# EAGLE design YARC_ID_Timer (EAGLE 7.2.0)
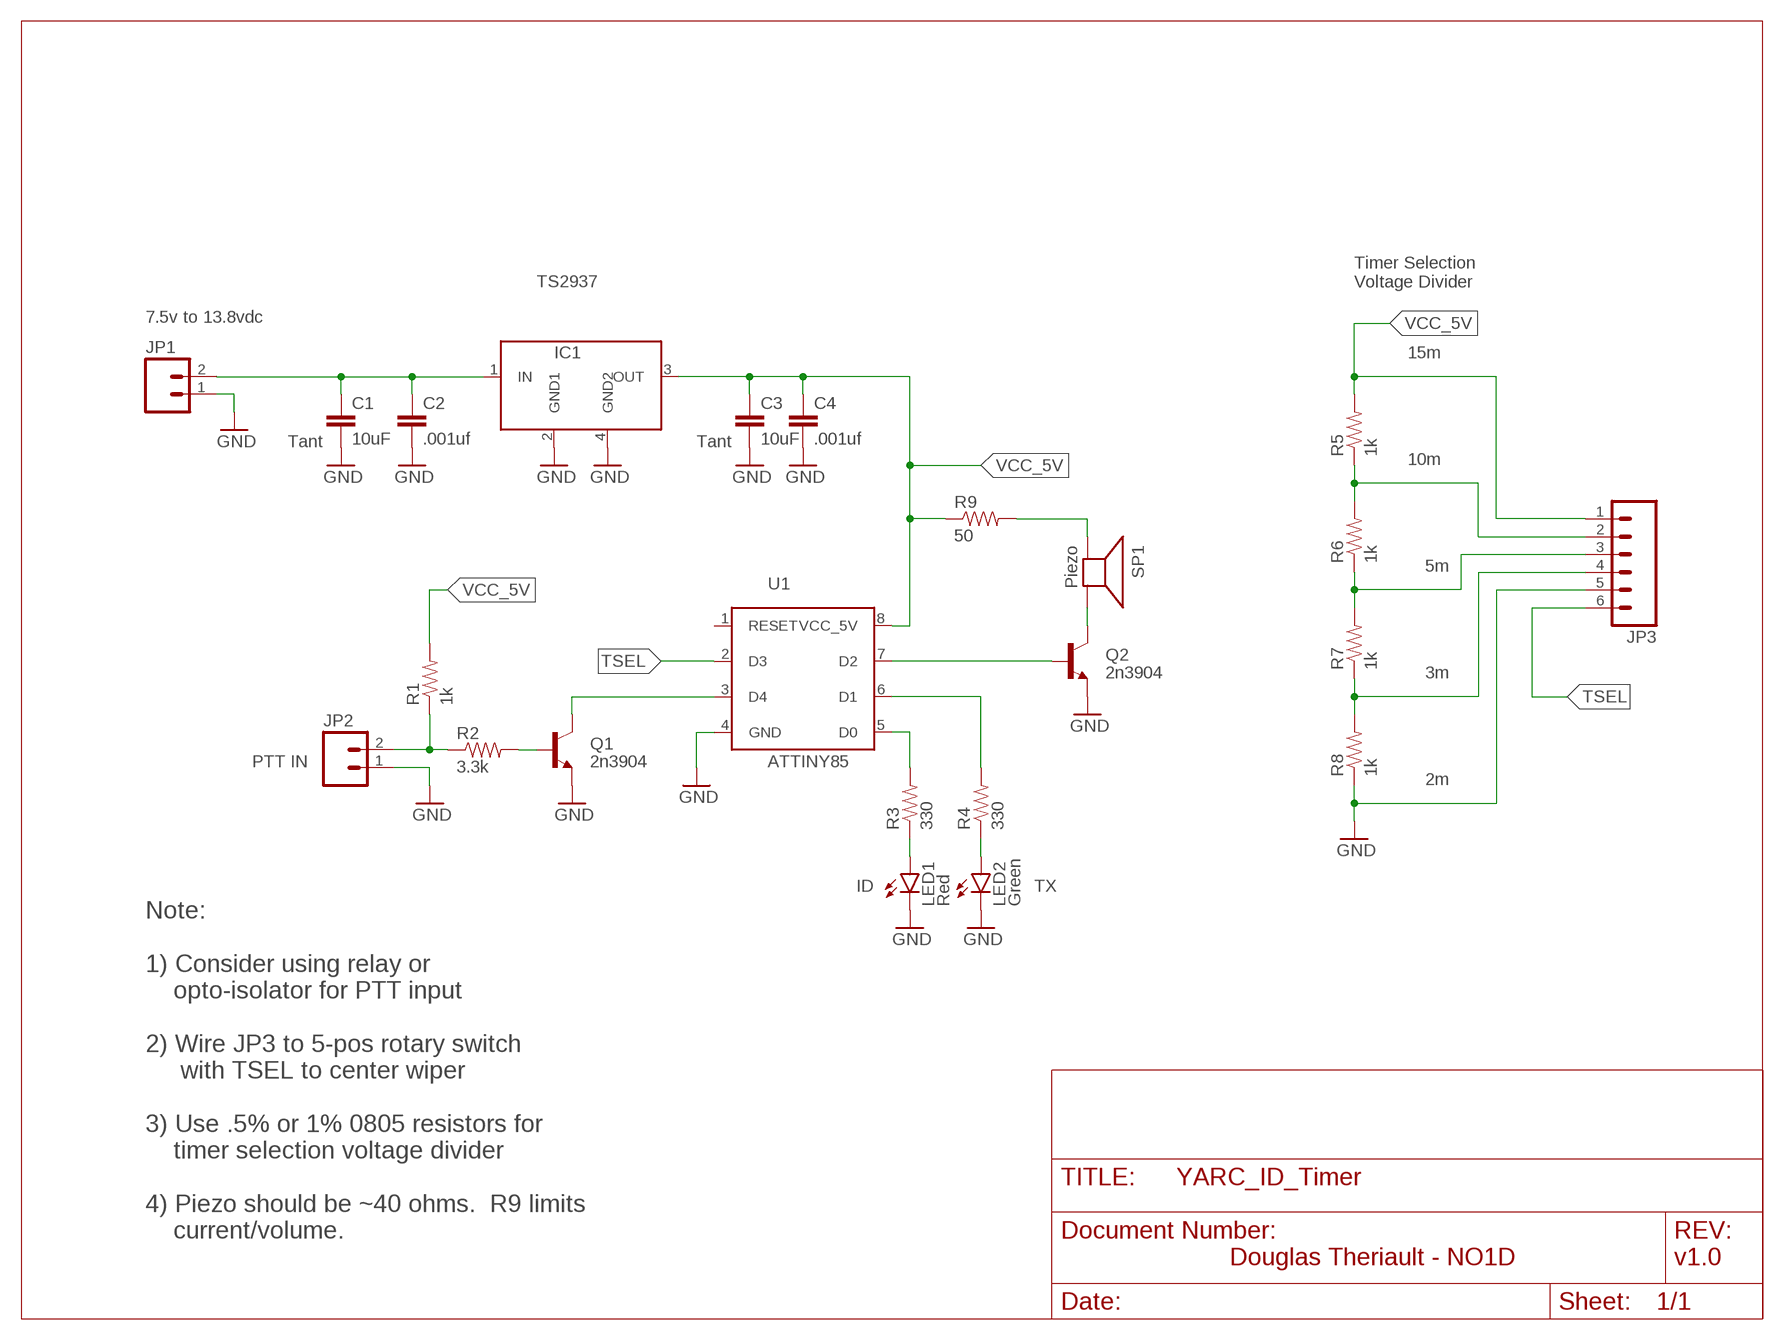
[diagram p0: schematic, sheet 1]

## Parts
C1  10uF  CAP1210  [1210]
C2  .001uf  CAP0805  [0805]
C3  10uF  CAP0805  [0805]
C4  .001uf  CAP0805  [0805]
IC1  TS2937  [SOT223]
JP1  M02LOCK_LONGPADS  [1X02_LOCK_LONGPADS]
JP2  M02LOCK_LONGPADS  [1X02_LOCK_LONGPADS]
JP3  M06LONGPADS  [1X06_LONGPADS]
LED1  Red  LED5MM  [LED5MM]
LED2  Green  LED5MM  [LED5MM]
Q1  2n3904  TRANSISTOR_NPN2N3904  [TO-92]
Q2  2n3904  TRANSISTOR_NPN2N3904  [TO-92]
R1  1k  RESISTOR0805-RES  [0805]
R2  3.3k  RESISTOR0805-RES  [0805]
R3  330  RESISTOR0805-RES  [0805]
R4  330  RESISTOR0805-RES  [0805]
R5  1k  RESISTOR0805-RES  [0805]
R6  1k  RESISTOR0805-RES  [0805]
R7  1k  RESISTOR0805-RES  [0805]
R8  1k  RESISTOR0805-RES  [0805]
R9  50  RESISTOR0805-RES  [0805]
SP1  Piezo  SPEAKER/AL60P  [AL60P]
U1  ATTINY85  [DIP08]

## Nets
GND: C1.2 C2.2 C3.2 C4.2 IC1.2(GND1) IC1.4(GND2) JP1.1 JP2.1 JP3.5 LED1.K(C) LED2.K(C) Q1.1(E) Q2.1(E) R8.1 U1.4(GND)
N$1: LED1.A R3.1
N$2: Q2.2(B) U1.7(D2)
N$3: Q2.3(C) SP1.2(-)
N$4: R9.2 SP1.1(+)
N$6: LED2.A R4.1
N$8: R3.2 U1.5(D0)
N$9: R4.2 U1.6(D1)
N$10: Q1.3(C) U1.3(D4)
N$11: Q1.2(B) R2.2
N$12: JP2.2 R1.1 R2.1
N$13: C1.1 C2.1 IC1.1(IN) JP1.2
N$14: JP3.2 R5.1 R6.2
N$15: JP3.3 R6.1 R7.2
N$16: JP3.4 R7.1 R8.2
TSEL: JP3.6 U1.2(D3)
VCC_5V: C3.1 C4.1 IC1.3(OUT) JP3.1 R1.2 R5.2 R9.1 U1.8(VCC_5V)
Unconnected: U1.1(RESET)

## Notes on the sheet
- Timer Selection
  Voltage Divider
- 7.5v to 13.8vdc
- 15m
- Tant | Tant
- 10m
- 5m
- 3m
- PTT IN
- 2m
- ID | TX
- Note:
  
  1) Consider using relay or 
      opto-isolator for PTT input
  
  2) Wire JP3 to 5-pos rotary switch
       with TSEL to center wiper
  
  3) Use .5% or 1% 0805 resistors for
      timer selection voltage divider
  
  4) Piezo should be ~40 ohms.  R9 limits
      current/volume.
- Douglas Theriault - NO1D | v1.0

## Library data of the parts
C1-C4 = SparkFun-Passives:CAP: Capacitor Standard 0603 ceramic capacitor, and 0.1" leaded capacitor.
IC1 = dt-semis:TS2937
JP1 JP2 = SparkFun-Connectors:M02: Standard 2-pin 0.1" header. Use with - straight break away headers ( PRT-00116) - right angle break away headers (PRT-00553) - swiss pins (PRT-00743) - machine pins (PRT-00117) - female headers (PRT-00115) Molex polarized connector foot print use with: PRT-08233 with associated crimp pins and housings. 2.54_SCREWTERM for use with PRT-10571. 3.5mm Screw Terminal footprints for PRT-08084 5mm Screw Terminal footprints for use with PRT-08432
JP3 = SparkFun-Connectors:M06: Header 6 Standard 6-pin 0.1" header. Use with straight break away headers (SKU : PRT-00116), right angle break away headers (PRT-00553), swiss pins (PRT-00743), machine pins (PRT-00117), and female headers (PRT-00115). Molex polarized connector foot print use with SKU : PRT-08094 with associated crimp pins and housings. NOTES ON THE VARIANTS LOCK and LOCK_LONGPADS... This footprint was designed to help hold the alignment of a through-hole component (i.e. 6-pin header) while soldering it into place. You may notice that each hole has been shifted either up or down by 0.005 of an inch from it's more standard position (which is a perfectly straight line). This slight alteration caused the pins (the squares in the middle) to touch the edges of the holes. Because they are alternating, it causes a "brace" to hold the component in place. 0.005 has proven to be the perfect amount of "off-center" position when using our standard breakaway headers. Although looks a little odd when you look at the bare footprint, once you have a header in there, the alteration is very hard to notice. Also,if you push a header all the way into place, it is covered up entirely on the bottom side. This idea of altering the position of holes to aid alignment will be further integrated into the Sparkfun Library for other footprints. It can help hold any component with 3 or more connection pins.
LED1 LED2 = SparkFun-LED:LED: LEDs Standard schematic elements and footprints for 5mm, 3mm, 1206, and 0603 sized LEDs. 5mm - Spark Fun Electronics SKU : COM-00529 (and others)
Q1 Q2 = SparkFun-DiscreteSemi:TRANSISTOR_NPN: Generic NPN BJT MMBT2222A - TRANS-08049 (SOT-23, 1A 40V) MPSA42 - TRANS-09116 (SOT-23, 500mA 300V) MMBT5088LT1G - TRANS-11160 (SOT-23, 50 mA 30V) BC547 - COM-08928 <http://www.sparkfun.com/products/8928> (TO-92 45V 100mA) (1.Collector 2.Base 3.Emitter) 2N3904 - COM-00521 <http://www.sparkfun.com/products/521> (TO-92 40V 200mA) (1.Emitter 2.Base 3.Collector) P2N2222A - COM-12852 <http://www.sparkfun.com/products/12852> (TO-92 40V 600mA) (1.Collector 2.Base 3.Emitter); PROD_ID: TRANS-08447
R1-R9 = SparkFun-Passives:RESISTOR: Resistor Basic schematic elements and footprints for 0603, 1206, and PTH resistors.
SP1 = adafruit:SPEAKER: SPEAKER Source: Buerklin Added PS12 (for part # PS1240 piezo) http://www.ladyada.net/library/pcb/eaglelibrary.html
U1 = dt-semis:ATTINY85

## Board
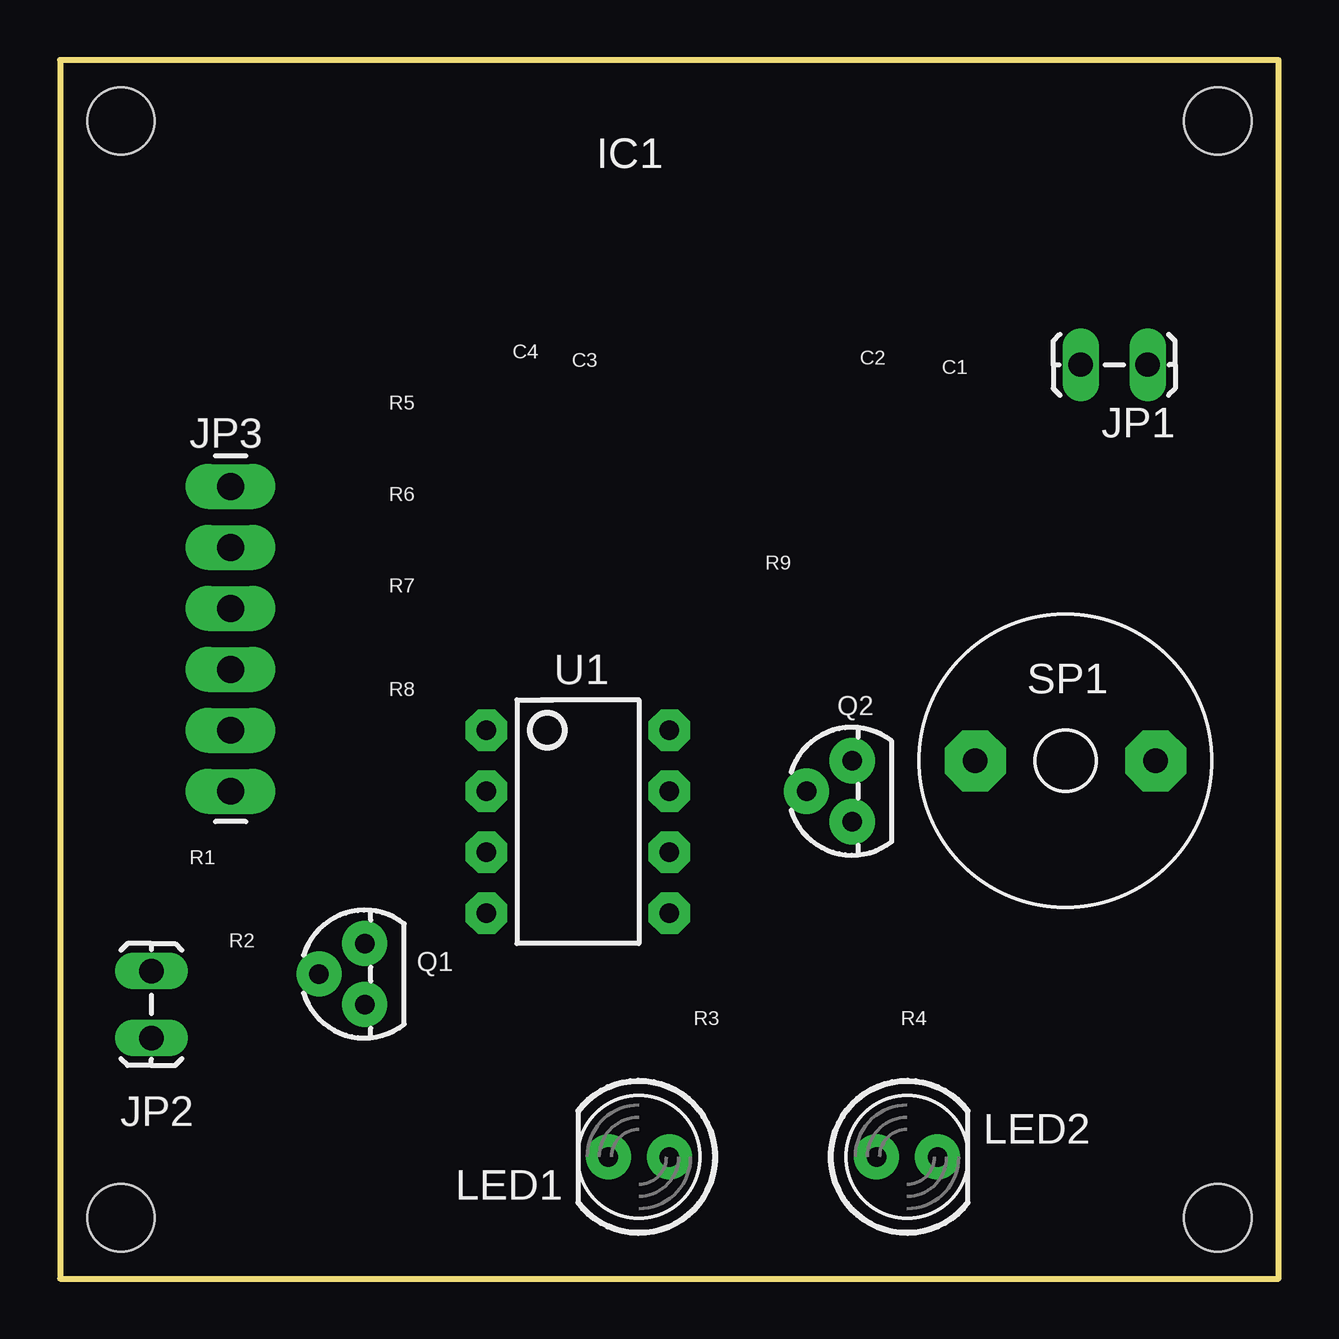
[diagram p1: board, top side]
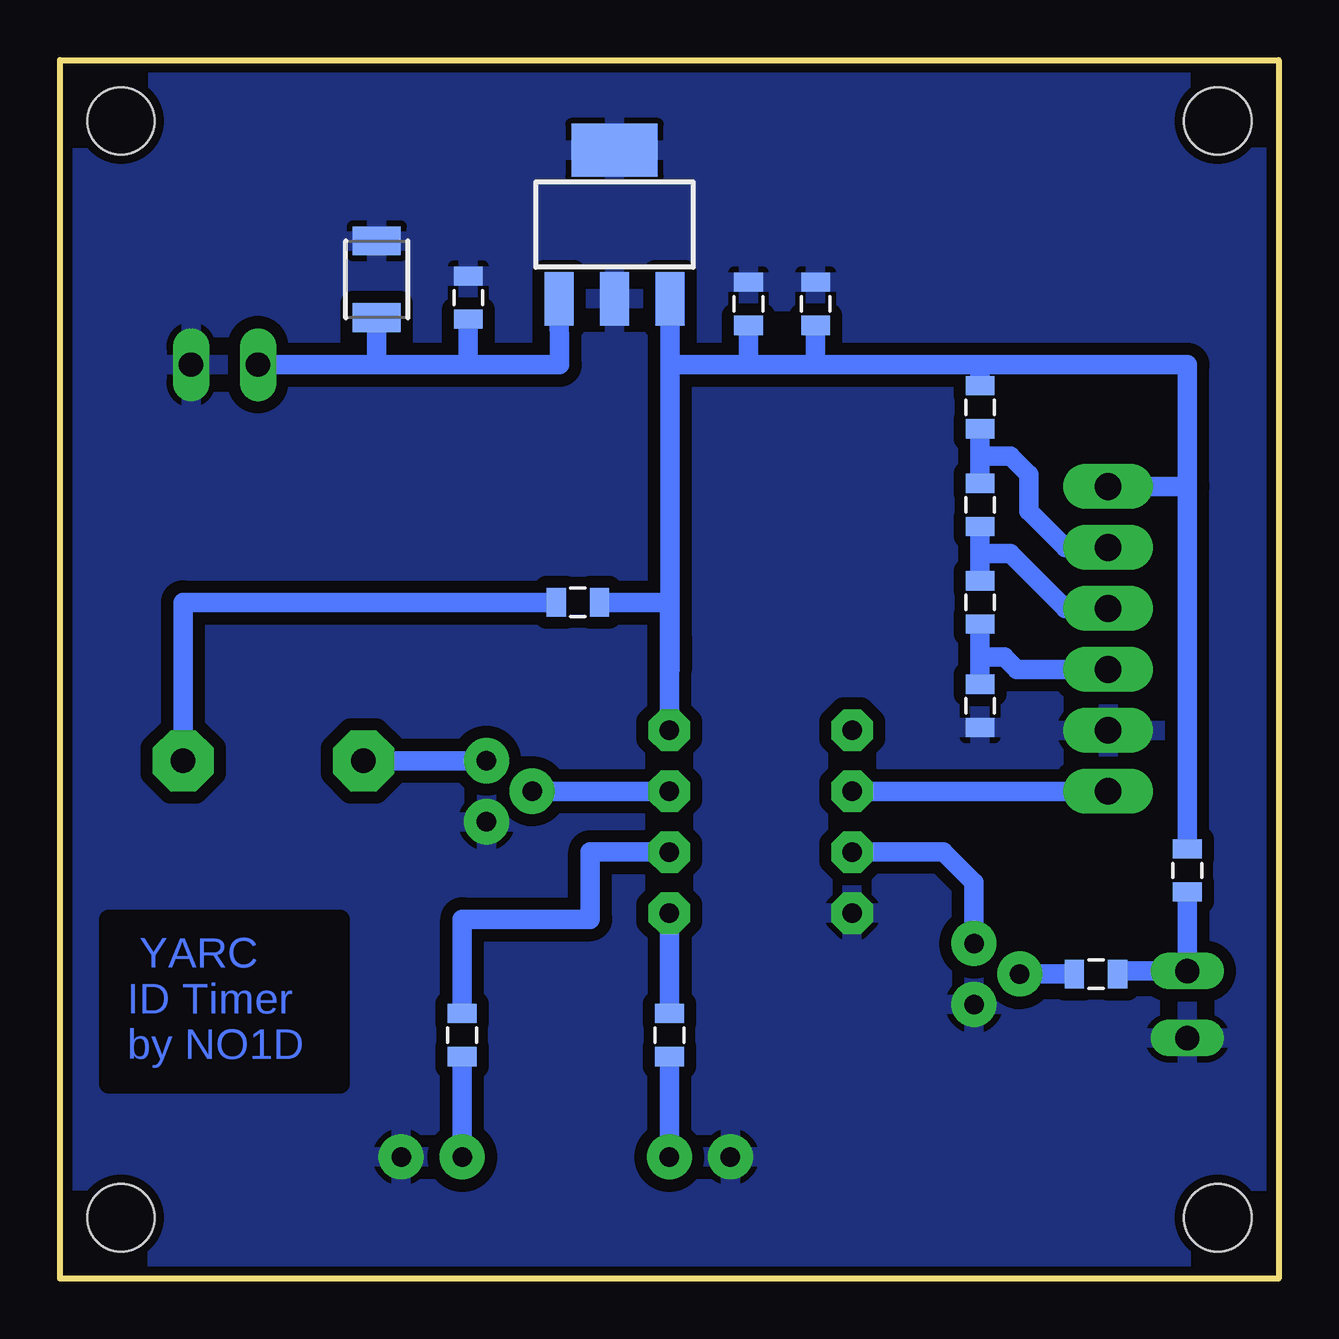
[diagram p2: board, bottom side, seen from below]

Size 50.8 x 50.8 mm. Coordinates in mm from the lower left corner, seen from the top.
Outline: 0,0 50.8,0 50.8,50.8 0,50.8 0,0
Copper layers (1*16): Top 0.0356mm / dielectric 1.5011mm / Bottom 0.0356mm
Design rules "LaenPCBOrder *": minimum track width 6mil, minimum drill 13mil, track to track 20mil, track to pad 20mil, pad to pad 16mil, via to via 6mil, smd to smd 6mil, copper to edge 15mil, drill to drill 6mil, minimum pad ring 7mil, minimum via ring 7mil, stop-mask expansion 3mil, vias tented up to drill 0mil, thermal gap 10mil
Holes 2.8 mm at 2.54,48.26 48.26,48.26 48.26,2.54 2.54,2.54
bRestrict: area 39.1,8.1 to 48.8,15

### Footprints (pad centres in the part's own frame; a part is rotated, then mirrored left to right if it is on the bottom)
1210 = smd 1.2 x 2: 1 -1.6,0; 2 1.6,0
0805 = smd 0.8 x 1.2: 1 -0.9,0; 2 0.9,0
SOT223 = smd 1.219 x 2.235: 1 -2.311,-3.099; 2 0,-3.099; 3 2.311,-3.099 | smd 3.6 x 2.2: 4 0,3.099
1X02_LOCK_LONGPADS = drill 1.016 long: 1 -0.127,0; 2 2.667,0
1X06_LONGPADS = drill 1.118 pad 1.88 long: 1 0,0; 2 2.54,0; 3 5.08,0; 4 7.62,0; 5 10.16,0; 6 12.7,0
LED5MM = drill 0.813 pad 1.88: A -1.27,0; K 1.27,0
TO-92 = drill 0.813 pad 1.88: 1 -1.27,0; 2 0,1.905; 3 1.27,0
AL60P = drill 1.016 pad 2.54 octagon: 1 -3.759,0; 2 3.759,0
DIP08 = drill 0.813 pad 1.727 octagon: 1 -3.81,-3.81; 2 -1.27,-3.81; 3 1.27,-3.81; 4 3.81,-3.81; 5 3.81,3.81; 6 1.27,3.81; 7 -1.27,3.81; 8 -3.81,3.81

### Placement (x,y rotation side)
C1  37.59,41.66 90 bottom
C2  33.78,40.89 90 bottom
C3  22.1,40.64 90 bottom
C4  19.3,40.64 90 bottom
IC1  27.69,43.94 0 bottom
JP1  45.21,38.1 180 top
JP2  3.81,10.16 90 top
JP3  7.11,33.02 270 top
LED1  24.13,5.08 180 top
LED2  35.31,5.08 0 top
Q1  12.7,12.7 90 top
Q2  33.02,20.32 90 top
R1  3.81,17.02 90 bottom
R2  7.62,12.7 180 bottom
R3  25.4,10.16 90 bottom
R4  34.04,10.16 90 bottom
R5  12.45,36.32 90 bottom
R6  12.45,32.26 90 bottom
R7  12.45,28.19 90 bottom
R8  12.45,23.88 90 bottom
R9  29.21,28.19 180 bottom
SP1  41.91,21.59 180 top
U1  21.59,19.05 270 top

### Tracks (layer width: path | path; a pad name or v marks a point on that pad's centre or on a via)
GND
  pour Bottom: 0,0 50.8,0 50.8,50.8 0,50.8
N$1
  Bottom 0.813: LED1.A R3.1
N$2
  Bottom 0.813: U1.7 30.99,20.32 Q2.2
N$3
  Bottom 0.813: Q2.3 SP1.2
N$4
  Bottom 0.813: SP1.1 45.67,28.19 R9.2
N$6
  Bottom 0.813: LED2.A R4.1
N$8
  Bottom 0.813: U1.5 R3.2
N$9
  Bottom 0.813: R4.2 34.04,14.99 28.7,14.99 28.7,17.78 U1.6
N$10
  Bottom 0.813: Q1.3 12.7,16.51 13.97,17.78 U1.3
N$11
  Bottom 0.813: Q1.2 R2.2
N$12
  Bottom 0.813: R2.1 6.59,12.83 JP2.2 R1.1
N$13
  Bottom 0.813: 37.59,38.1 33.78,38.1 | 33.78,38.1 29.97,38.1 IC1.1 | C2.1 33.78,38.1 | C1.1 37.59,38.1 | JP1.2 37.59,38.1
N$14
  Bottom 0.813: R5.1 12.45,34.29 | 12.45,34.29 R6.2 | JP3.2 8.89,30.48 10.41,32 10.41,33.53 11.18,34.29 12.45,34.29
N$15
  Bottom 0.813: R6.1 12.45,30.23 | 12.45,30.23 R7.2 | JP3.3 8.89,27.94 11.18,30.23 12.45,30.23
N$16
  Bottom 0.813: R7.1 12.45,25.91 | 12.45,25.91 R8.2 | JP3.4 10.92,25.4 11.43,25.91 12.45,25.91
TSEL
  Bottom 0.813: JP3.6 U1.2
VCC_5V
  Bottom 0.813: 25.38,38.1 22.1,38.1 | 22.1,38.1 19.3,38.1 | 19.3,38.1 12.45,38.1 | C4.1 19.3,38.1 | C3.1 22.1,38.1 | U1.8 25.4,28.19 | R1.2 3.81,33.02 | 3.81,33.02 3.81,38.1 12.45,38.1 | R9.1 25.4,28.19 | 25.38,38.1 IC1.3 | 25.4,28.19 25.38,25.4 25.38,38.1 | R5.2 12.45,38.1 | JP3.1 3.81,33.02

### Text on the board
Bottom: YARC / ID Timer / by NO1D